# EAGLE schematic sch (EAGLE 7.1.0)
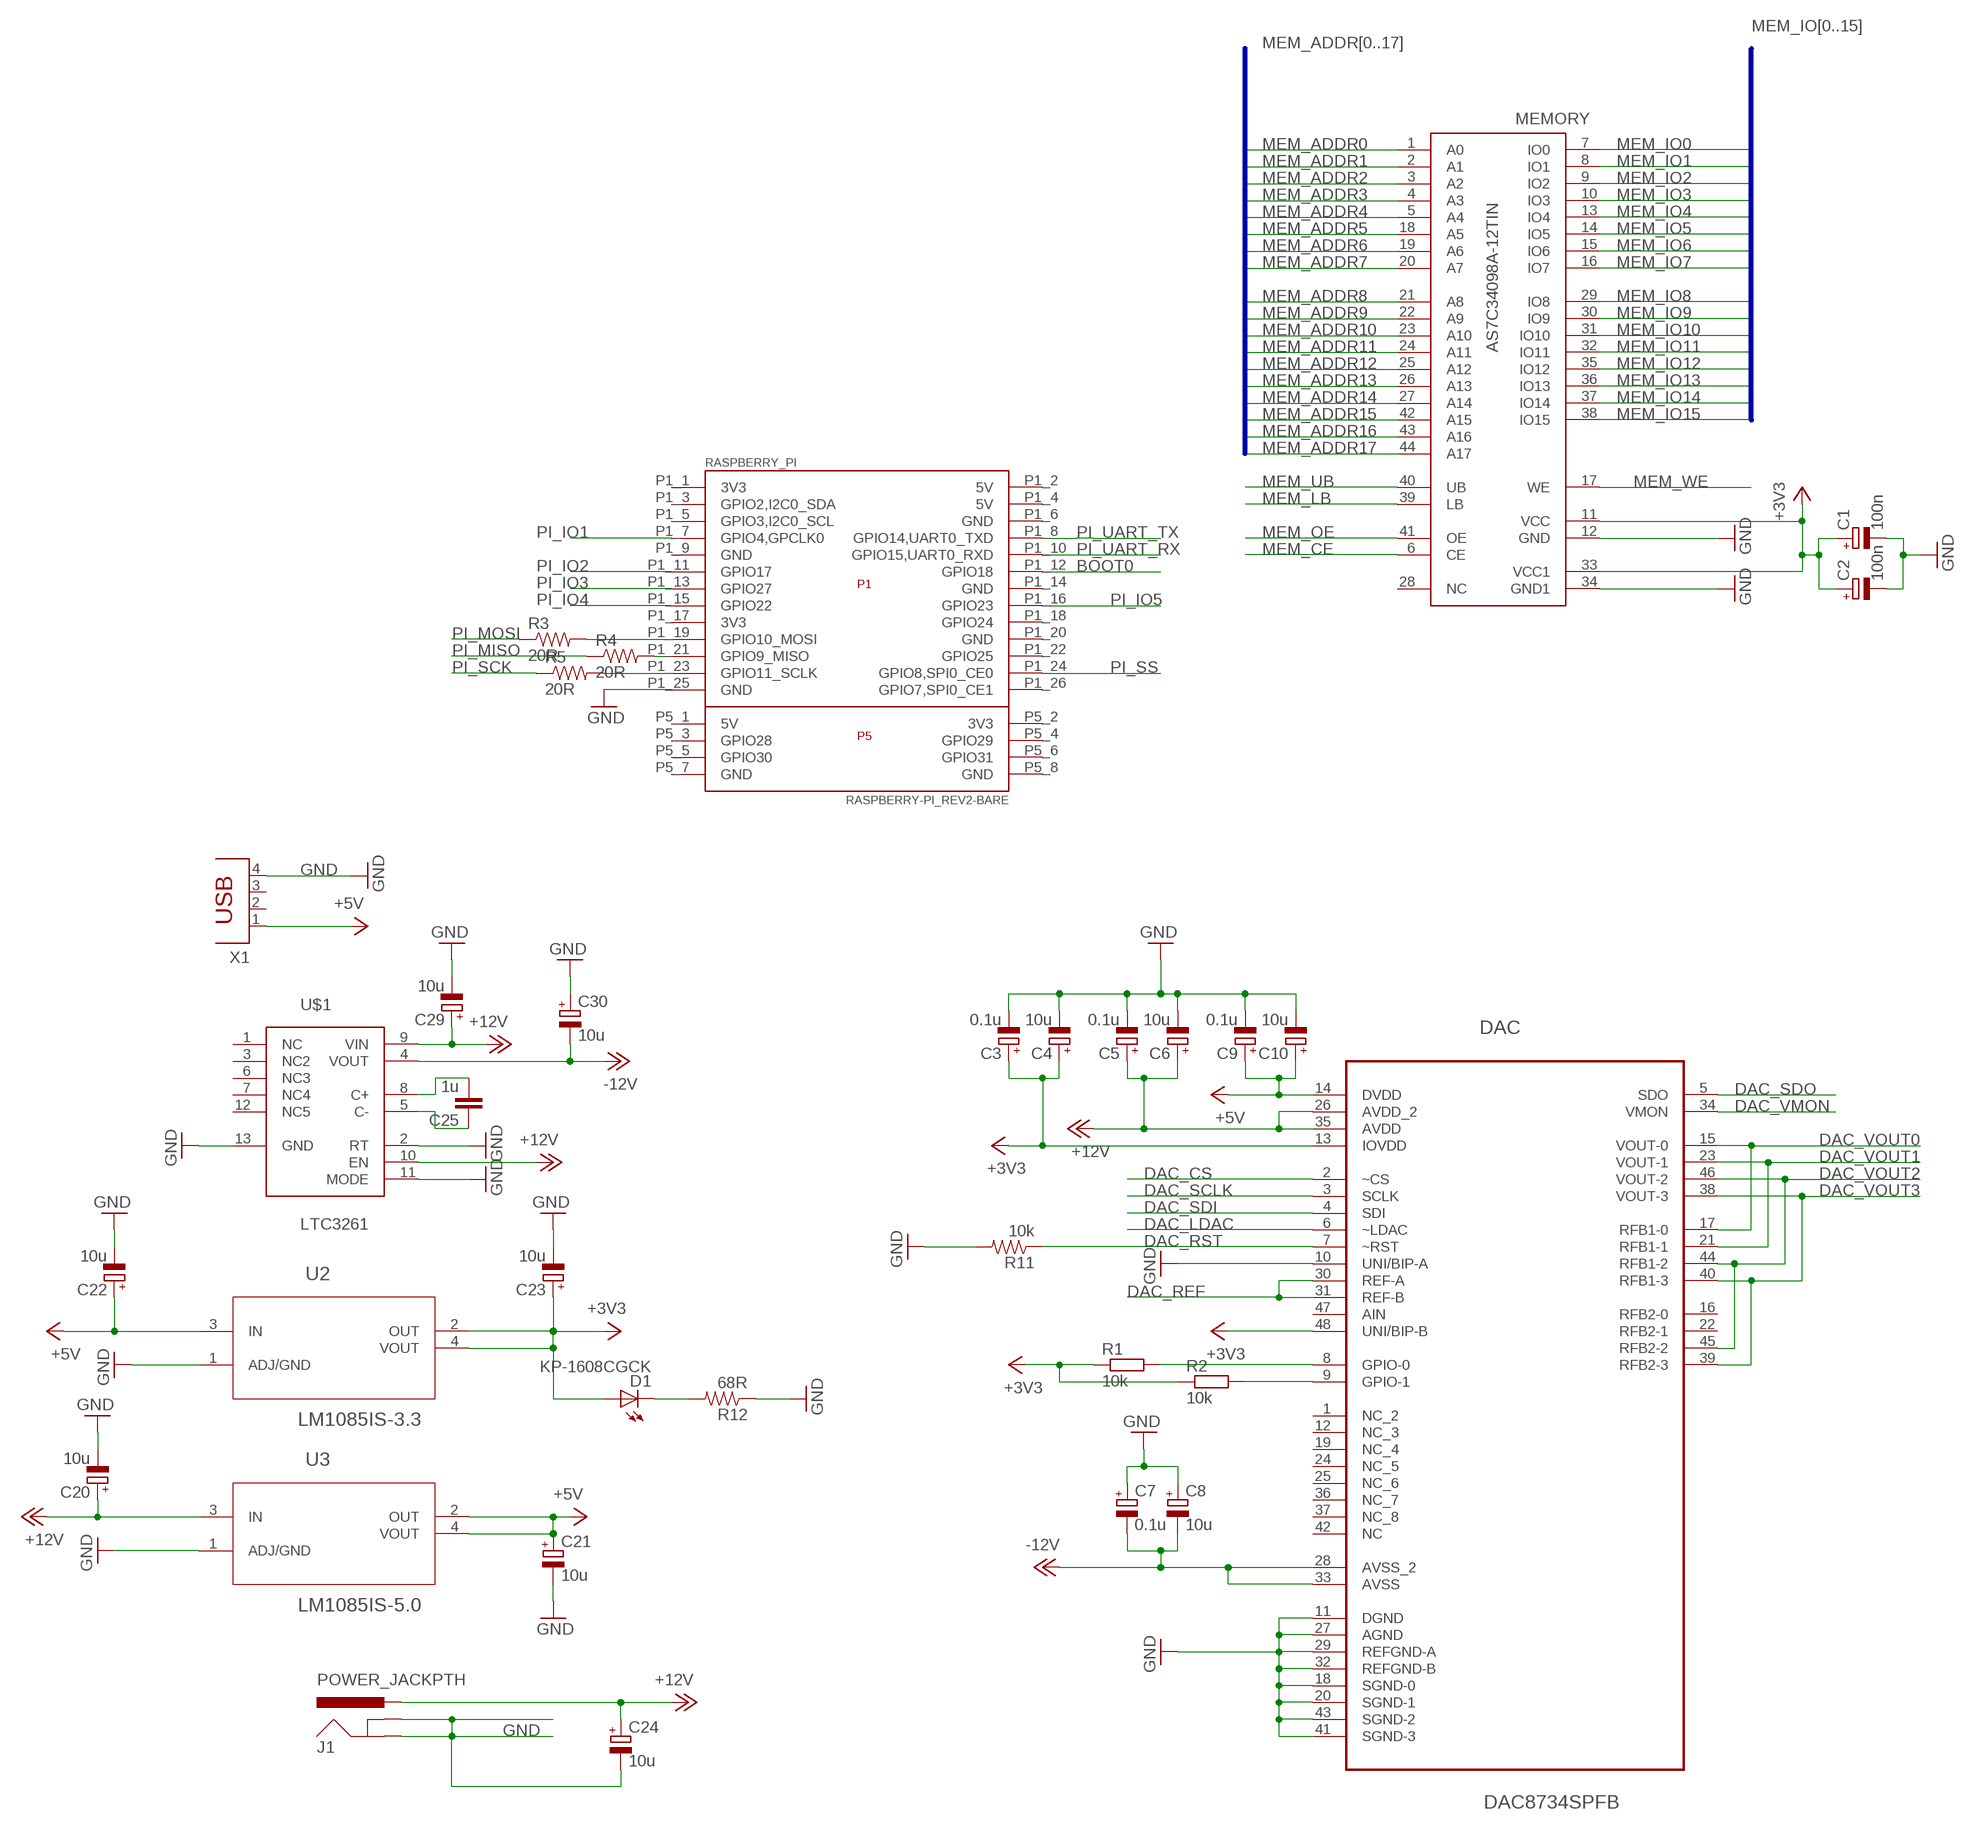
[diagram p0: schematic, sheet 1, part 1 of 2]
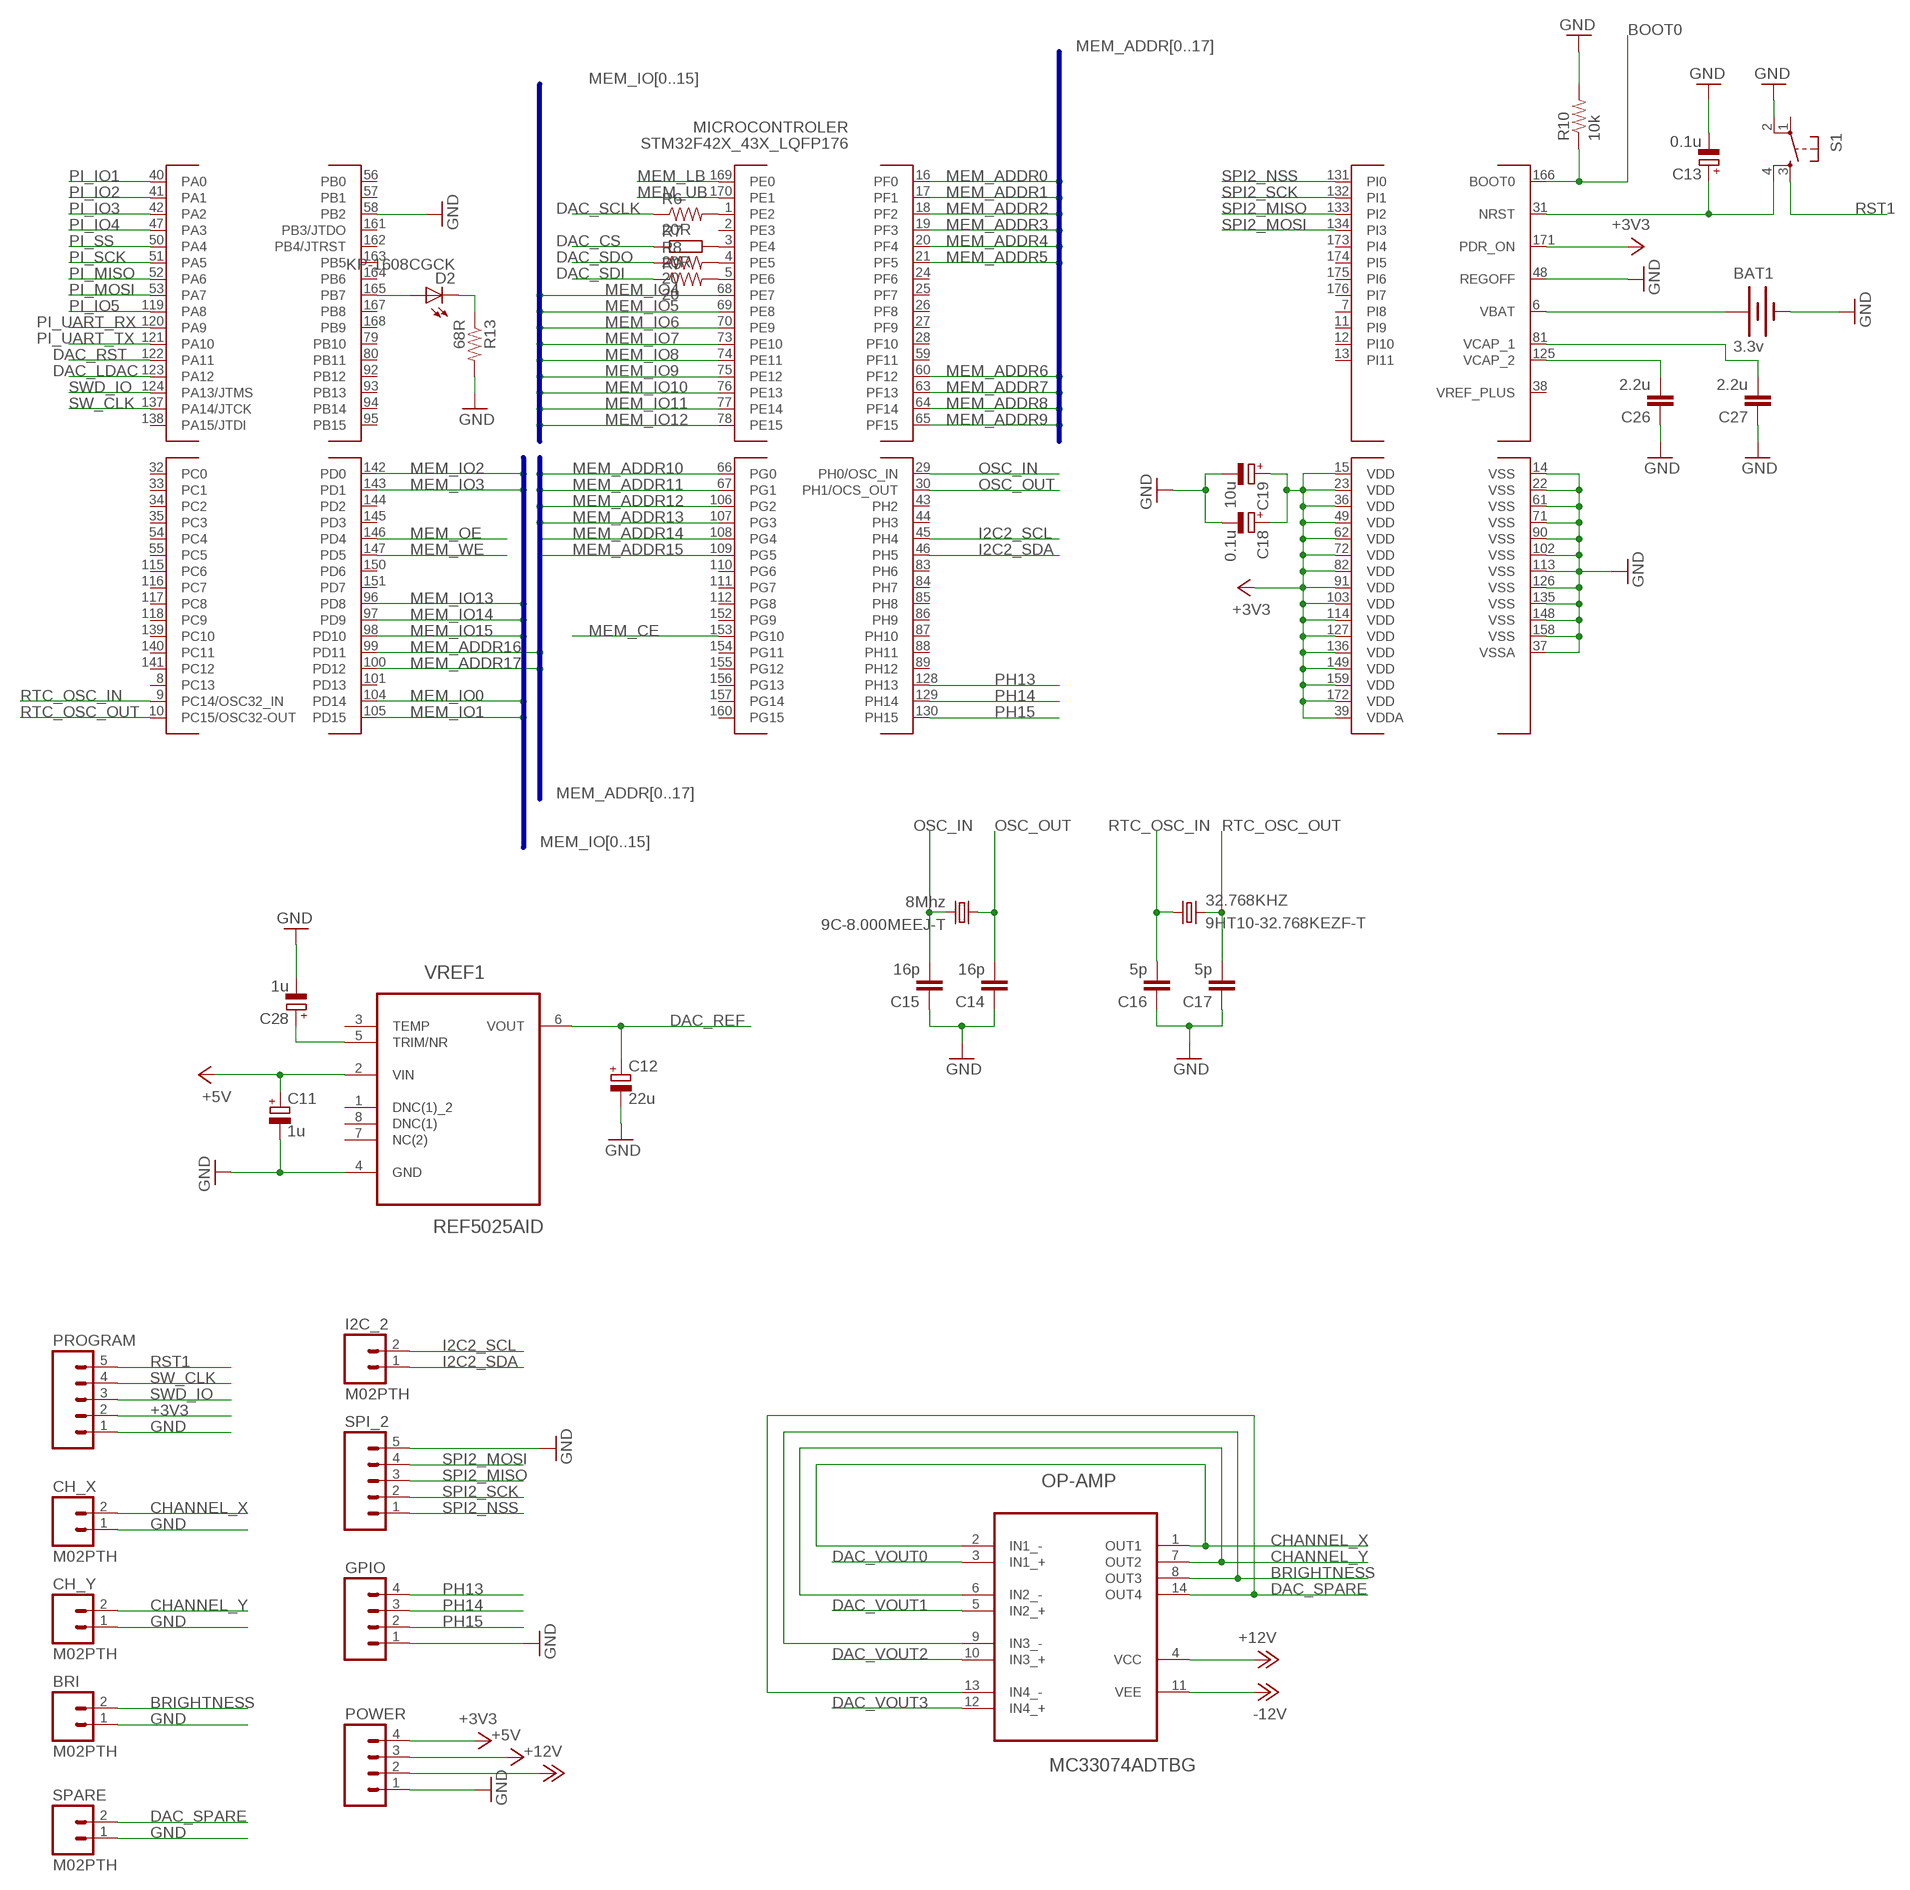
[diagram p1: schematic, sheet 1, part 2 of 2]

## Parts
9C-8.000MEEJ-T  8Mhz  CSM-7X-DU  [CSM-7X-DU]
32.768KHZ  9HT10-32.768KEZF-T  [9HT10-32.768KEZF-T]
BAT1  3.3v  BATTERY12MM  [BATTCON_12MM]
BRI  M02PTH  [1X02]
C1  100n  CPOL-EUSMCA  [SMC_A]
C2  100n  CPOL-EUSMCA  [SMC_A]
C3  0.1u  CPOL-EUSMCA  [SMC_A]
C4  10u  CPOL-EUSMCA  [SMC_A]
C5  0.1u  CPOL-EUSMCA  [SMC_A]
C6  10u  CPOL-EUSMCA  [SMC_A]
C7  0.1u  CPOL-EUSMCA  [SMC_A]
C8  10u  CPOL-EUSMCA  [SMC_A]
C9  0.1u  CPOL-EUSMCA  [SMC_A]
C10  10u  CPOL-EUSMCA  [SMC_A]
C11  1u  CPOL-EUSMCA  [SMC_A]
C12  22u  CPOL-EUSMCA  [SMC_A]
C13  0.1u  CPOL-EUSMCA  [SMC_A]
C14  16p  C-EUC0603  [C0603]
C15  16p  C-EUC0603  [C0603]
C16  5p  C-EUC0603  [C0603]
C17  5p  C-EUC0603  [C0603]
C18  0.1u  CPOL-EUSMCA  [SMC_A]
C19  10u  CPOL-EUSMCA  [SMC_A]
C20  10u  CPOL-EUSMCA  [SMC_A]
C21  10u  CPOL-EUSMCA  [SMC_A]
C22  10u  CPOL-EUSMCA  [SMC_A]
C23  10u  CPOL-EUSMCA  [SMC_A]
C24  10u  CPOL-EUSMCA  [SMC_A]
C25  1u  C-EUC0603  [C0603]
C26  2.2u  C-EUC0603  [C0603]
C27  2.2u  C-EUC0603  [C0603]
C28  1u  CPOL-EUSMCA  [SMC_A]
C29  10u  CPOL-EUSMCA  [SMC_A]
C30  10u  CPOL-EUSMCA  [SMC_A]
CH_X  M02PTH  [1X02]
CH_Y  M02PTH  [1X02]
D1  KP-1608CGCK  LED-GREEN0603  [LED-0603]
D2  KP-1608CGCK  LED-GREEN0603  [LED-0603]
DAC  DAC8734SPFB  [QFP50P900X900X120-48N]
GPIO  M04PTH  [1X04]
I2C_2  M02PTH  [1X02]
J1  POWER_JACKPTH  [POWER_JACK_PTH]
MEMORY  AS7C34098A-12TIN  [TSOPII-44]
MICROCONTROLER  STM32F42X_43X_LQFP176  [LQFP176_PACKAGE]
OP-AMP  MC33074ADTBG  [SOP65P640X120-14N]
POWER  M04PTH  [1X04]
PROGRAM  M05PTH  [1X05]
R1  10k  R-EU_R0805  [R0805]
R2  10k  R-EU_R0805  [R0805]
R3  20R  RESISTOR0603-RES  [0603-RES]
R4  20R  RESISTOR0603-RES  [0603-RES]
R5  20R  RESISTOR0603-RES  [0603-RES]
R6  20R  RESISTOR0603-RES  [0603-RES]
R7  20R  R-EU_R0603  [R0603]
R8  20  RESISTOR0603-RES  [0603-RES]
R9  20  RESISTOR0603-RES  [0603-RES]
R10  10k  RESISTOR0603-RES  [0603-RES]
R11  10k  RESISTOR0603-RES  [0603-RES]
R12  68R  RESISTOR0603-RES  [0603-RES]
R13  68R  RESISTOR0603-RES  [0603-RES]
RASPBERRY_PI  RASPBERRY-PI_REV2-BARE  [RASPBERRY-PI_REV2-BARE]
S1  TAC_SWITCHSMD  [TACTILE_SWITCH_SMD]
SPARE  M02PTH  [1X02]
SPI_2  M05PTH  [1X05]
U2  LM1085IS-3.3  [TO254P1435X457-3N]
U3  LM1085IS-5.0  [TO254P1435X457-3N]
U$1  LTC3261  LTC3261"  [MSOP12]
VREF1  REF5025AID  [SOIC127P600X175-8N]
X1  PN87520  [PN87520]

## Nets
+3V3: C1.+ C2.+ C3.+ C4.+ C18.+ C19.+ C23.+ D1.A DAC.13(IOVDD) DAC.48(UNI/BIP-B) MEMORY.11(VCC) MEMORY.33(VCC1) MICROCONTROLER.15(VDD) MICROCONTROLER.23(VDD) MICROCONTROLER.36(VDD) MICROCONTROLER.39(VDDA) MICROCONTROLER.49(VDD) MICROCONTROLER.62(VDD) MICROCONTROLER.72(VDD) MICROCONTROLER.82(VDD) MICROCONTROLER.91(VDD) MICROCONTROLER.103(VDD) MICROCONTROLER.114(VDD) MICROCONTROLER.127(VDD) MICROCONTROLER.136(VDD) MICROCONTROLER.149(VDD) MICROCONTROLER.159(VDD) MICROCONTROLER.171(PDR_ON) MICROCONTROLER.172(VDD) POWER.4 PROGRAM.2 R1.1 R2.1 U2.2(OUT) U2.4(VOUT)
+5V: C9.+ C10.+ C11.+ C21.+ C22.+ DAC.14(DVDD) POWER.3 U2.3(IN) U3.2(OUT) U3.4(VOUT) VREF1.2(VIN) X1.1
+12V: C5.+ C6.+ C20.+ C24.+ C29.+ DAC.26(AVDD_2) DAC.35(AVDD) J1.PWR OP-AMP.4(VCC) POWER.2 U3.3(IN) U$1.9(VIN) U$1.10(EN)
-12V: C7.- C8.- C30.- DAC.28(AVSS_2) DAC.33(AVSS) OP-AMP.11(VEE) U$1.4(VOUT)
BOOT0: MICROCONTROLER.166(BOOT0) R10.1 RASPBERRY_PI.P1_12(GPIO18)
BRIGHTNESS: BRI.2 OP-AMP.8(OUT3) OP-AMP.9(IN3_-)
CHANNEL_X: CH_X.2 OP-AMP.1(OUT1) OP-AMP.2(IN1_-)
CHANNEL_Y: CH_Y.2 OP-AMP.6(IN2_-) OP-AMP.7(OUT2)
DAC_CS: DAC.2(~CS) R7.1
DAC_LDAC: DAC.6(~LDAC) MICROCONTROLER.123(PA12)
DAC_REF: C12.+ DAC.30(REF-A) DAC.31(REF-B) VREF1.6(VOUT)
DAC_RST: DAC.7(~RST) MICROCONTROLER.122(PA11) R11.1
DAC_SCLK: DAC.3(SCLK) R6.1
DAC_SDI: DAC.4(SDI) R9.1
DAC_SDO: DAC.5(SDO) R8.1
DAC_SPARE: OP-AMP.13(IN4_-) OP-AMP.14(OUT4) SPARE.2
DAC_VMON: DAC.34(VMON)
DAC_VOUT0: DAC.15(VOUT-0) DAC.17(RFB1-0) OP-AMP.3(IN1_+)
DAC_VOUT1: DAC.21(RFB1-1) DAC.23(VOUT-1) OP-AMP.5(IN2_+)
DAC_VOUT2: DAC.44(RFB1-2) DAC.45(RFB2-2) DAC.46(VOUT-2) OP-AMP.10(IN3_+)
DAC_VOUT3: DAC.38(VOUT-3) DAC.39(RFB2-3) DAC.40(RFB1-3) OP-AMP.12(IN4_+)
GND: BAT1.GND(-) BRI.1 C1.- C2.- C3.- C4.- C5.- C6.- C7.+ C8.+ C9.- C10.- C11.- C12.- C13.- C14.1 C15.1 C16.1 C17.1 C18.- C19.- C20.- C21.- C22.- C23.- C24.- C26.1 C27.1 C28.- C29.- C30.+ CH_X.1 CH_Y.1 DAC.10(UNI/BIP-A) DAC.11(DGND) DAC.18(SGND-0) DAC.20(SGND-1) DAC.27(AGND) DAC.29(REFGND-A) DAC.32(REFGND-B) DAC.41(SGND-3) DAC.43(SGND-2) GPIO.1 J1.GND J1.GNDBREAK MEMORY.12(GND) MEMORY.34(GND1) MICROCONTROLER.14(VSS) MICROCONTROLER.22(VSS) MICROCONTROLER.37(VSSA) MICROCONTROLER.48(REGOFF) MICROCONTROLER.58(PB2) MICROCONTROLER.61(VSS) MICROCONTROLER.71(VSS) MICROCONTROLER.90(VSS) MICROCONTROLER.102(VSS) MICROCONTROLER.113(VSS) MICROCONTROLER.126(VSS) MICROCONTROLER.135(VSS) MICROCONTROLER.148(VSS) MICROCONTROLER.158(VSS) POWER.1 PROGRAM.1 R10.2 R11.2 R12.1 R13.2 RASPBERRY_PI.P1_25(GND) S1.2 SPARE.1 SPI_2.5 U2.1(ADJ/GND) U3.1(ADJ/GND) U$1.2(RT) U$1.11(MODE) U$1.13(GND) VREF1.4(GND) X1.4
I2C2_SCL: I2C_2.2 MICROCONTROLER.45(PH4)
I2C2_SDA: I2C_2.1 MICROCONTROLER.46(PH5)
MEM_ADDR0: MEMORY.1(A0) MICROCONTROLER.16(PF0)
MEM_ADDR1: MEMORY.2(A1) MICROCONTROLER.17(PF1)
MEM_ADDR2: MEMORY.3(A2) MICROCONTROLER.18(PF2)
MEM_ADDR3: MEMORY.4(A3) MICROCONTROLER.19(PF3)
MEM_ADDR4: MEMORY.5(A4) MICROCONTROLER.20(PF4)
MEM_ADDR5: MEMORY.18(A5) MICROCONTROLER.21(PF5)
MEM_ADDR6: MEMORY.19(A6) MICROCONTROLER.60(PF12)
MEM_ADDR7: MEMORY.20(A7) MICROCONTROLER.63(PF13)
MEM_ADDR8: MEMORY.21(A8) MICROCONTROLER.64(PF14)
MEM_ADDR9: MEMORY.22(A9) MICROCONTROLER.65(PF15)
MEM_ADDR10: MEMORY.23(A10) MICROCONTROLER.66(PG0)
MEM_ADDR11: MEMORY.24(A11) MICROCONTROLER.67(PG1)
MEM_ADDR12: MEMORY.25(A12) MICROCONTROLER.106(PG2)
MEM_ADDR13: MEMORY.26(A13) MICROCONTROLER.107(PG3)
MEM_ADDR14: MEMORY.27(A14) MICROCONTROLER.108(PG4)
MEM_ADDR15: MEMORY.42(A15) MICROCONTROLER.109(PG5)
MEM_ADDR16: MEMORY.43(A16) MICROCONTROLER.99(PD11)
MEM_ADDR17: MEMORY.44(A17) MICROCONTROLER.100(PD12)
MEM_CE: MEMORY.6(CE) MICROCONTROLER.153(PG10)
MEM_IO0: MEMORY.7(IO0) MICROCONTROLER.104(PD14)
MEM_IO1: MEMORY.8(IO1) MICROCONTROLER.105(PD15)
MEM_IO2: MEMORY.9(IO2) MICROCONTROLER.142(PD0)
MEM_IO3: MEMORY.10(IO3) MICROCONTROLER.143(PD1)
MEM_IO4: MEMORY.13(IO4) MICROCONTROLER.68(PE7)
MEM_IO5: MEMORY.14(IO5) MICROCONTROLER.69(PE8)
MEM_IO6: MEMORY.15(IO6) MICROCONTROLER.70(PE9)
MEM_IO7: MEMORY.16(IO7) MICROCONTROLER.73(PE10)
MEM_IO8: MEMORY.29(IO8) MICROCONTROLER.74(PE11)
MEM_IO9: MEMORY.30(IO9) MICROCONTROLER.75(PE12)
MEM_IO10: MEMORY.31(IO10) MICROCONTROLER.76(PE13)
MEM_IO11: MEMORY.32(IO11) MICROCONTROLER.77(PE14)
MEM_IO12: MEMORY.35(IO12) MICROCONTROLER.78(PE15)
MEM_IO13: MEMORY.36(IO13) MICROCONTROLER.96(PD8)
MEM_IO14: MEMORY.37(IO14) MICROCONTROLER.97(PD9)
MEM_IO15: MEMORY.38(IO15) MICROCONTROLER.98(PD10)
MEM_LB: MEMORY.39(LB) MICROCONTROLER.169(PE0)
MEM_OE: MEMORY.41(OE) MICROCONTROLER.146(PD4)
MEM_UB: MEMORY.40(UB) MICROCONTROLER.170(PE1)
MEM_WE: MEMORY.17(WE) MICROCONTROLER.147(PD5)
N$1: DAC.8(GPIO-0) R1.2
N$2: DAC.9(GPIO-1) R2.2
N$3: D1.C R12.2
N$4: D2.A MICROCONTROLER.165(PB7)
N$5: R3.2 RASPBERRY_PI.P1_19(GPIO10_MOSI)
N$6: C25.2 U$1.8(C+)
N$7: R4.2 RASPBERRY_PI.P1_21(GPIO9_MISO)
N$8: R5.2 RASPBERRY_PI.P1_23(GPIO11_SCLK)
N$9: MICROCONTROLER.5(PE6) R9.2
N$10: MICROCONTROLER.4(PE5) R8.2
N$11: MICROCONTROLER.3(PE4) R7.2
N$12: MICROCONTROLER.1(PE2) R6.2
N$13: C25.1 U$1.5(C-)
N$14: D2.C R13.1
N$15: C26.2 MICROCONTROLER.125(VCAP_2)
N$16: C27.2 MICROCONTROLER.81(VCAP_1)
N$17: C28.+ VREF1.5(TRIM/NR)
OSC_IN: 9C-8.000MEEJ-T.2 C15.2 MICROCONTROLER.29(PH0/OSC_IN)
OSC_OUT: 9C-8.000MEEJ-T.1 C14.2 MICROCONTROLER.30(PH1/OCS_OUT)
PH13: GPIO.4 MICROCONTROLER.128(PH13)
PH14: GPIO.3 MICROCONTROLER.129(PH14)
PH15: GPIO.2 MICROCONTROLER.130(PH15)
PI_IO1: MICROCONTROLER.40(PA0) RASPBERRY_PI.P1_7(GPIO4,GPCLK0)
PI_IO2: MICROCONTROLER.41(PA1) RASPBERRY_PI.P1_11(GPIO17)
PI_IO3: MICROCONTROLER.42(PA2) RASPBERRY_PI.P1_13(GPIO27)
PI_IO4: MICROCONTROLER.47(PA3) RASPBERRY_PI.P1_15(GPIO22)
PI_IO5: MICROCONTROLER.119(PA8) RASPBERRY_PI.P1_16(GPIO23)
PI_MISO: MICROCONTROLER.52(PA6) R4.1
PI_MOSI: MICROCONTROLER.53(PA7) R3.1
PI_SCK: MICROCONTROLER.51(PA5) R5.1
PI_SS: MICROCONTROLER.50(PA4) RASPBERRY_PI.P1_24(GPIO8,SPI0_CE0)
PI_UART_RX: MICROCONTROLER.120(PA9) RASPBERRY_PI.P1_10(GPIO15,UART0_RXD)
PI_UART_TX: MICROCONTROLER.121(PA10) RASPBERRY_PI.P1_8(GPIO14,UART0_TXD)
RST0: C13.+ MICROCONTROLER.31(NRST) S1.4
RST1: PROGRAM.5 S1.3
RTC_OSC_IN: 32.768KHZ.P$1 C16.2 MICROCONTROLER.9(PC14/OSC32_IN)
RTC_OSC_OUT: 32.768KHZ.P$2 C17.2 MICROCONTROLER.10(PC15/OSC32-OUT)
SPI2_MISO: MICROCONTROLER.133(PI2) SPI_2.3
SPI2_MOSI: MICROCONTROLER.134(PI3) SPI_2.4
SPI2_NSS: MICROCONTROLER.131(PI0) SPI_2.1
SPI2_SCK: MICROCONTROLER.132(PI1) SPI_2.2
SW_CLK: MICROCONTROLER.137(PA14/JTCK) PROGRAM.4
SWD_IO: MICROCONTROLER.124(PA13/JTMS) PROGRAM.3
VBAT: BAT1.PWR@1(+) MICROCONTROLER.6(VBAT)
Unconnected: DAC.1(NC_2) DAC.12(NC_3) DAC.16(RFB2-0) DAC.19(NC_4) DAC.22(RFB2-1) DAC.24(NC_5) DAC.25(NC_6) DAC.36(NC_7) DAC.37(NC_8) DAC.42(NC) DAC.47(AIN) MEMORY.28(NC) MICROCONTROLER.2(PE3) MICROCONTROLER.7(PI8) MICROCONTROLER.8(PC13) MICROCONTROLER.11(PI9) MICROCONTROLER.12(PI10) MICROCONTROLER.13(PI11) MICROCONTROLER.24(PF6) MICROCONTROLER.25(PF7) MICROCONTROLER.26(PF8) MICROCONTROLER.27(PF9) MICROCONTROLER.28(PF10) MICROCONTROLER.32(PC0) MICROCONTROLER.33(PC1) MICROCONTROLER.34(PC2) MICROCONTROLER.35(PC3) MICROCONTROLER.38(VREF_PLUS) MICROCONTROLER.43(PH2) MICROCONTROLER.44(PH3) MICROCONTROLER.54(PC4) MICROCONTROLER.55(PC5) MICROCONTROLER.56(PB0) MICROCONTROLER.57(PB1) MICROCONTROLER.59(PF11) MICROCONTROLER.79(PB10) MICROCONTROLER.80(PB11) MICROCONTROLER.83(PH6) MICROCONTROLER.84(PH7) MICROCONTROLER.85(PH8) MICROCONTROLER.86(PH9) MICROCONTROLER.87(PH10) MICROCONTROLER.88(PH11) MICROCONTROLER.89(PH12) MICROCONTROLER.92(PB12) MICROCONTROLER.93(PB13) MICROCONTROLER.94(PB14) MICROCONTROLER.95(PB15) MICROCONTROLER.101(PD13) MICROCONTROLER.110(PG6) MICROCONTROLER.111(PG7) MICROCONTROLER.112(PG8) MICROCONTROLER.115(PC6) MICROCONTROLER.116(PC7) MICROCONTROLER.117(PC8) MICROCONTROLER.118(PC9) MICROCONTROLER.138(PA15/JTDI) MICROCONTROLER.139(PC10) MICROCONTROLER.140(PC11) MICROCONTROLER.141(PC12) MICROCONTROLER.144(PD2) MICROCONTROLER.145(PD3) MICROCONTROLER.150(PD6) MICROCONTROLER.151(PD7) MICROCONTROLER.152(PG9) MICROCONTROLER.154(PG11) MICROCONTROLER.155(PG12) MICROCONTROLER.156(PG13) MICROCONTROLER.157(PG14) MICROCONTROLER.160(PG15) MICROCONTROLER.161(PB3/JTDO) MICROCONTROLER.162(PB4/JTRST) MICROCONTROLER.163(PB5) MICROCONTROLER.164(PB6) MICROCONTROLER.167(PB8) MICROCONTROLER.168(PB9) MICROCONTROLER.173(PI4) MICROCONTROLER.174(PI5) MICROCONTROLER.175(PI6) MICROCONTROLER.176(PI7) RASPBERRY_PI.P1_1(3V3) RASPBERRY_PI.P1_2(5V) RASPBERRY_PI.P1_3(GPIO2,I2C0_SDA) RASPBERRY_PI.P1_4(5V) RASPBERRY_PI.P1_5(GPIO3,I2C0_SCL) RASPBERRY_PI.P1_6(GND) RASPBERRY_PI.P1_9(GND) RASPBERRY_PI.P1_14(GND) RASPBERRY_PI.P1_17(3V3) RASPBERRY_PI.P1_18(GPIO24) RASPBERRY_PI.P1_20(GND) RASPBERRY_PI.P1_22(GPIO25) RASPBERRY_PI.P1_26(GPIO7,SPI0_CE1) RASPBERRY_PI.P5_1(5V) RASPBERRY_PI.P5_2(3V3) RASPBERRY_PI.P5_3(GPIO28) RASPBERRY_PI.P5_4(GPIO29) RASPBERRY_PI.P5_5(GPIO30) RASPBERRY_PI.P5_6(GPIO31) RASPBERRY_PI.P5_7(GND) RASPBERRY_PI.P5_8(GND) S1.1 U$1.1(NC) U$1.3(NC2) U$1.6(NC3) U$1.7(NC4) U$1.12(NC5) VREF1.1(DNC(1)_2) VREF1.3(TEMP) VREF1.7(NC(2)) VREF1.8(DNC(1)) X1.2 X1.3

## Buses
MEM_ADDR[0..17]
MEM_IO[0..15]

## Library data of the parts
9C-8.000MEEJ-T = crystal:CSM-7X-DU: SMD CRYSTAL Source: www.ecsxtal.com .. Crystal 3.6864MHz CSM_7X_DU.PDF; OC_FARNELL: unknown; OC_NEWARK: unknown
32.768KHZ = EagleParts:9HT10-32.768KEZF-T
BAT1 = SparkFun-Electromechanical:BATTERY: Battery Holders Various common sizes : AA, AAA, 20mm coin cell and 12mm coin cell. 20MM_4LEGS, BATT-10373
BRI CH_X CH_Y I2C_2 SPARE = SparkFun-Connectors:M02: Standard 2-pin 0.1" header. Use with - straight break away headers ( PRT-00116) - right angle break away headers (PRT-00553) - swiss pins (PRT-00743) - machine pins (PRT-00117) - female headers (PRT-00115) Molex polarized connector foot print use with: PRT-08233 with associated crimp pins and housings. 2.54_SCREWTERM for use with PRT-10571. 3.5mm Screw Terminal footprints for PRT-08084 5mm Screw Terminal footprints for use with PRT-08433
C1-C13 C18-C24 C28-C30 = resistor:CPOL-EU: POLARIZED CAPACITOR, European symbol
C14-C17 C25-C27 = resistor:C-EU: CAPACITOR, European symbol
D1 D2 = SparkFun-LED:LED-GREEN: Various green LEDs 0603- DIO-00821 LARGE- DIO-00862 LILYPAD- DIO-09910; PROD_ID: DIO-00821; VALUE: GREEN
DAC = DAC8734:DAC8734SPFB: Quad, 16-BIT DAC; MPN: DAC8734SPFB; OC_FARNELL: 2082437; OC_NEWARK: 89T8681; PACKAGE: TQFP-48; SUPPLIER: Texas Instruments
GPIO POWER = SparkFun-Connectors:M04: Header 4 Standard 4-pin 0.1" header. Use with straight break away headers (SKU : PRT-00116), right angle break away headers (PRT-00553), swiss pins (PRT-00743), machine pins (PRT-00117), and female headers (PRT-00115). Molex polarized connector foot print use with SKU : PRT-08231 with associated crimp pins and housings. 1MM SMD Version SKU: PRT-10208
J1 = SparkFun-Connectors:POWER_JACK: Power Jack This is the standard 5.5mm barrel jack for power. The PTH is the most common, proven, reliable, footprint. The Slot footprint only works if the mill layer is transmitted to the PCB fab house so be warned. Spark Fun Electronics SKU : PRT-00119 SMT: CONN-08106 Mating wall wart : TOL-00298 (and others)
MEMORY = EagleParts:AS7C34098A-12TIN
MICROCONTROLER = EagleParts:STM32F42X_43X_LQFP176: STM32F42x_43x_LQFP176 edit this description Auto generated by make-symbol-device-package-bsdl.ulp Rev. 43 Source: STM32F42x_43x_LQFP176.bsd
OP-AMP = EagleParts:MC33074ADTBG: Single Supply 3.0 V to 44 V OPAMPs; MPN: MC33074ADTBG; OC_FARNELL: 1705871; OC_NEWARK: 42K0572; PACKAGE: TSSOP-14; SUPPLIER: On Semiconductor
PROGRAM SPI_2 = SparkFun-Connectors:M05: Header 5 Standard 5-pin 0.1" header. Use with straight break away headers (SKU : PRT-00116), right angle break away headers (PRT-00553), swiss pins (PRT-00743), machine pins (PRT-00117), and female headers (PRT-00115). Molex polarized connector foot print use with SKU : PRT-08230 with associated crimp pins and housings.
R1 R2 R7 = resistor:R-EU_: RESISTOR, European symbol
R3-R6 R8-R13 = SparkFun-Passives:RESISTOR: Resistor Basic schematic elements and footprints for 0603, 1206, and PTH resistors.
RASPBERRY_PI = RaspberryPi:RASPBERRY-PI_REV2-BARE
S1 = SparkFun-Electromechanical:TAC_SWITCH: Momentary Switch Button commonly used for reset or general input. Spark Fun Electronics SKU : COM-00097 SMT- SWCH-08247; PROD_ID: SWCH-08247
U2 = EagleParts:LM1085IS-3.3: Low Dropout Positive Regulators; MPN: LM1085IS-3.3; OC_FARNELL: 1469039; OC_NEWARK: 41K3373; PACKAGE: TO-263-3; SUPPLIER: National Semiconductor
U3 = EagleParts:LM1085IS-5.0: Low Dropout Positive Regulators; MPN: LM1085IS-5.0; OC_FARNELL: 1469040; OC_NEWARK: 41K3374; PACKAGE: TO-263-3; SUPPLIER: National Semiconductor
U$1 = EagleParts:LTC3261
VREF1 = EagleParts:REF5025AID: Low-Noise, Very Low Drift, Precision VOLTAGE REFERENCE; MPN: REF5025AID; OC_FARNELL: 1439622; OC_NEWARK: 50M8895; PACKAGE: SOIC-8; SUPPLIER: Texas Instruments
X1 = con-berg:PN87520: BERG USB connector; OC_FARNELL: unknown; OC_NEWARK: unknown

## Net classes
0 default: width 0.254 mm, drill 0.254 mm, clearance 0.254 mm